# EAGLE design OpticalSpeedometerV1 (EAGLE 9.4.2)
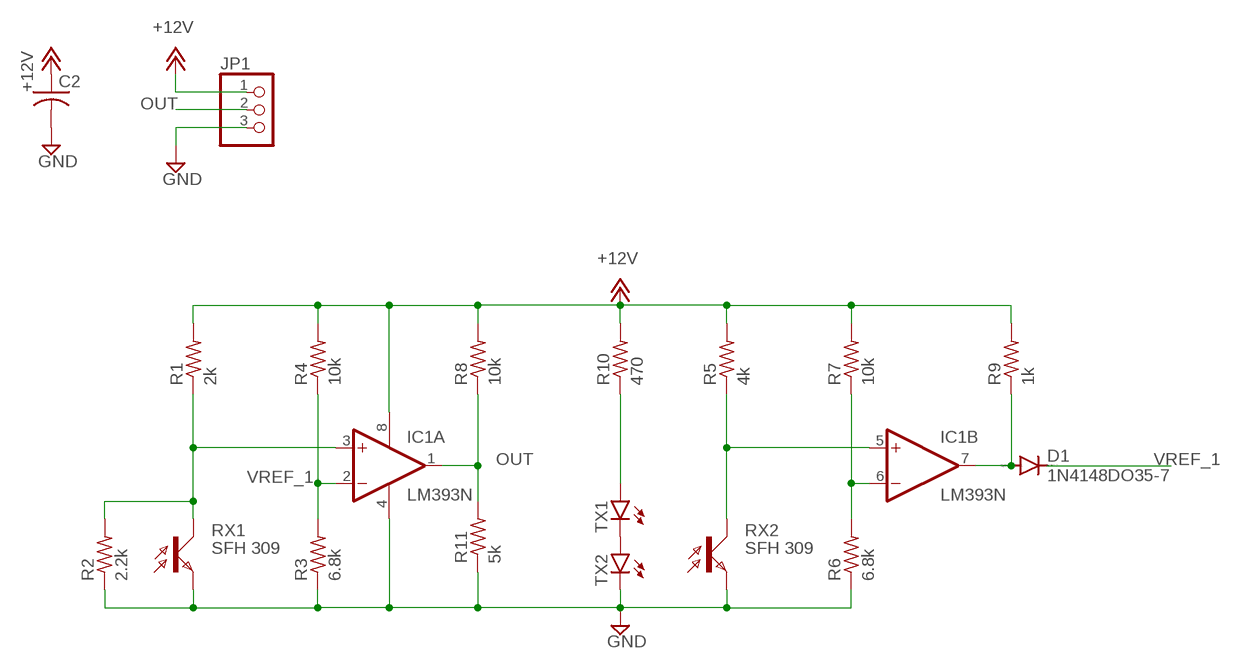
[diagram p0: schematic, sheet 1]

## Parts
C2  C-US050-050X075  [C050-050X075]
D1  1N4148DO35-7  [DO35-7]
IC1  LM393N  [DIL08]
JP1  PINHD-1X3  [1X03]
R1  2k  R-US_0204/5  [0204/5]
R2  2.2k  R-US_0204/5  [0204/5]
R3  6.8k  R-US_0204/5  [0204/5]
R4  10k  R-US_0204/5  [0204/5]
R5  4k  R-US_0204/5  [0204/5]
R6  6.8k  R-US_0204/5  [0204/5]
R7  10k  R-US_0204/5  [0204/5]
R8  10k  R-US_0204/5  [0204/5]
R9  1k  R-US_0204/5  [0204/5]
R10  470  R-US_0204/5  [0204/5]
R11  5k  R-US_0204/5  [0204/5]
RX1  SFH 309  BPX81  [BPX81]
RX2  SFH 309  BPX81  [BPX81]
TX1  LED3MM  [LED3MM]
TX2  LED3MM  [LED3MM]

## Nets
+12V: C2.1 IC1.8(P:V+) JP1.1 R1.2 R4.2 R5.2 R7.2 R8.2 R9.2 R10.2
GND: C2.2 IC1.4(P:V-) JP1.3 R2.1 R3.1 R6.1 R11.1 RX1.E RX2.E TX2.K(C)
N$1: TX1.K(C) TX2.A
N$2: IC1.3(A:+IN) R1.1 R2.2 RX1.C
N$3: R10.1 TX1.A
N$7: IC1.5(B:+IN) R5.1 RX2.C
N$9: IC1.6(B:-IN) R6.2 R7.1
N$10: D1.A IC1.7(B:OUT) R9.1
OUT: IC1.1(A:OUT) JP1.2 R8.1 R11.2
VREF_1: D1.C IC1.2(A:-IN) R3.2 R4.1

## Library data of the parts
C2 = rcl:C-US: CAPACITOR, American symbol; SPICEPREFIX: C
D1 = diode:1N4148: DIODE high speed (Philips)
IC1 = linear:LM393: COMPARATOR
JP1 = pinhead:PINHD-1X3: PIN HEADER
R1-R11 = rcl:R-US_: RESISTOR, American symbol; SPICEPREFIX: R
RX1 RX2 = opto-trans-siemens:BPX81: PHOTO TRANSISTOR; OC_FARNELL: unknown; OC_NEWARK: unknown
TX1 TX2 = led:LED: LED OSRAM: - CHIPLED LG R971, LG N971, LY N971, LG Q971, LY Q971, LO R971, LY R971 LH N974, LH R974 LS Q976, LO Q976, LY Q976 LO Q996 - Hyper CHIPLED LW Q18S LB Q993, LB Q99A, LB R99A - SideLED LS A670, LO A670, LY A670, LG A670, LP A670 LB A673, LV A673, LT A673, LW A673 LH A674 LY A675 LS A676, LA A676, LO A676, LY A676, LW A676 LS A679, LY A679, LG A679 - Hyper Micro SIDELED® LS Y876, LA Y876, LO Y876, LY Y876 LT Y87S - SmartLED LW L88C, LW L88S LB L89C, LB L89S, LG L890 LS L89K, LO L89K, LY L89K LS L896, LA L896, LO L896, LY L896 - TOPLED LS T670, LO T670, LY T670, LG T670, LP T670 LSG T670, LSP T670, LSY T670, LOP T670, LYG T670 LG T671, LOG T671, LSG T671 LB T673, LV T673, LT T673, LW T673 LH T674 LS T676, LA T676, LO T676, LY T676, LB T676, LH T676, LSB T676, LW T676 LB T67C, LV T67C, LT T67C, LS T67K, LO T67K, LY T67K, LW E67C LS E67B, LA E67B, LO E67B, LY E67B, LB E67C, LV E67C, LT E67C LW T67C LS T679, LY T679, LG T679 LS T770, LO T770, LY T770, LG T770, LP T770 LB T773, LV T773, LT T773, LW T773 LH T774 LS E675, LA E675, LY E675, LS T675 LS T776, LA T776, LO T776, LY T776, LB T776 LHGB T686 LT T68C, LB T68C - Hyper Mini TOPLED® LB M676 - Mini TOPLED Santana® LG M470 LS M47K, LO M47K, LY M47K Source: http://www.osram.convergy.de LUXEON: - LUMILED® LXK2-PW12-R00, LXK2-PW12-S00, LXK2-PW14-U00, LXK2-PW14-V00 LXK2-PM12-R00, LXK2-PM12-S00, LXK2-PM14-U00 LXK2-PE12-Q00, LXK2-PE12-R00, LXK2-PE12-S00, LXK2-PE14-T00, LXK2-PE14-U00 LXK2-PB12-K00, LXK2-PB12-L00, LXK2-PB12-M00, LXK2-PB14-N00, LXK2-PB14-P00, LXK2-PB14-Q00 LXK2-PR12-L00, LXK2-PR12-M00, LXK2-PR14-Q00, LXK2-PR14-R00 LXK2-PD12-Q00, LXK2-PD12-R00, LXK2-PD12-S00 LXK2-PH12-R00, LXK2-PH12-S00 LXK2-PL12-P00, LXK2-PL12-Q00, LXK2-PL12-R00 Source: www.luxeon.com KINGBRIGHT: KA-3528ASYC Source: www.kingbright.com

## Board
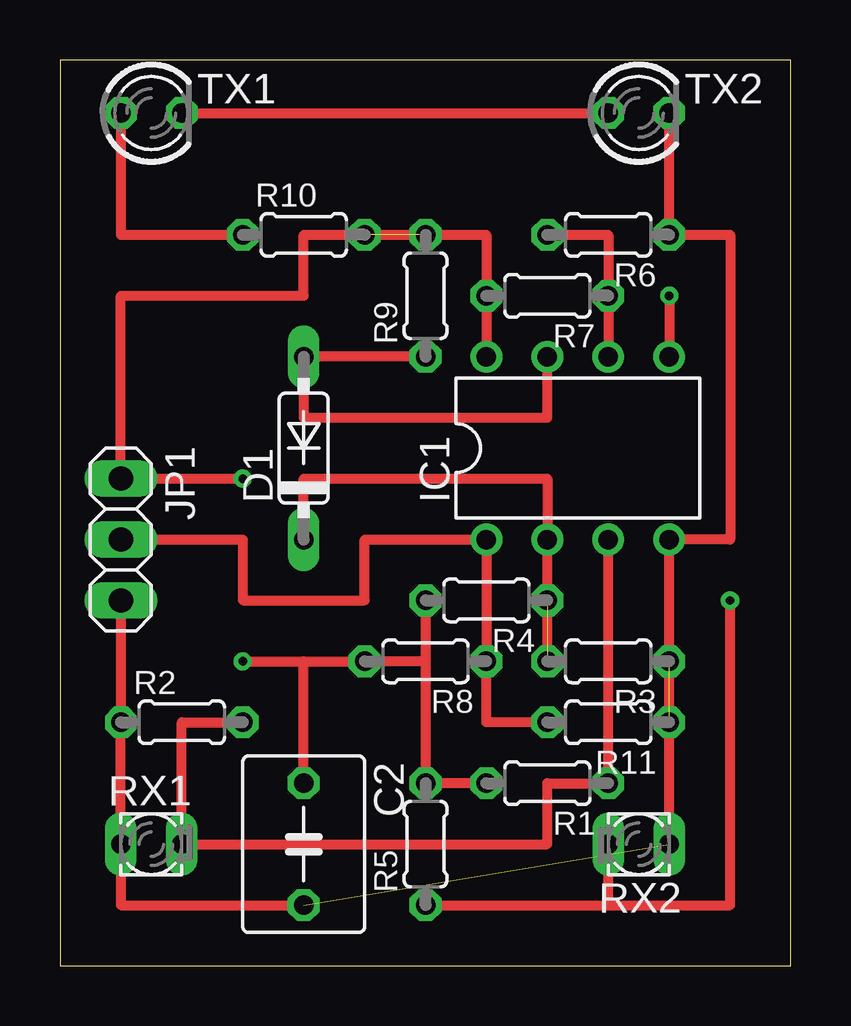
[diagram p1: board, top side]
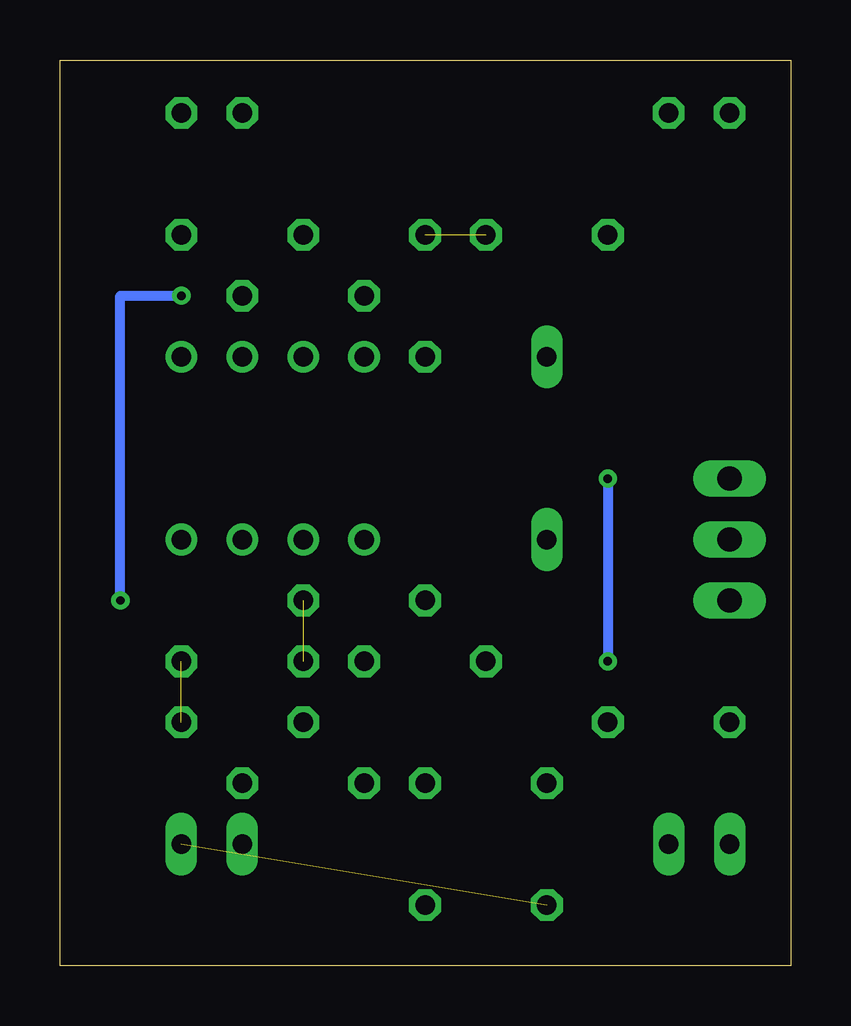
[diagram p2: board, bottom side, seen from below]

Size 30.46 x 37.77 mm. Coordinates in mm from the lower left corner, seen from the top.
Outline: 0,0 30.46,0 30.46,37.77 0,37.77 0,0
Copper layers (1*16): Top 0.035mm / dielectric 1.5mm / Bottom 0.035mm
Design rules "default": minimum track width 6mil, minimum drill 0.35mm, track to track 6mil, track to pad 6mil, pad to pad 6mil, via to via 6mil, smd to smd 6mil, copper to edge 40mil, drill to drill 6mil, minimum pad ring 10mil, minimum via ring 8mil, stop-mask expansion 4mil, vias tented up to drill 0mil, thermal gap 10mil

### Footprints (pad centres in the part's own frame; a part is rotated, then mirrored left to right if it is on the bottom)
C050-050X075 = drill 0.813 octagon: 1 -2.54,0; 2 2.54,0
DO35-7 = drill 0.813 long: A 3.81,0; C -3.81,0
DIL08 = drill 0.813 pad 1.27: 1 -3.81,-3.81; 2 -1.27,-3.81; 3 1.27,-3.81; 4 3.81,-3.81; 5 3.81,3.81; 6 1.27,3.81; 7 -1.27,3.81; 8 -3.81,3.81
1X03 = drill 1.016 long: 1 -2.54,0; 2 0,0; 3 2.54,0
0204/5 = drill 0.813 octagon: 1 -2.54,0; 2 2.54,0
BPX81 = drill 0.813 long: C 1.27,0; E -1.27,0
LED3MM = drill 0.813 octagon: A -1.27,0; K 1.27,0

### Placement (x,y rotation side)
C2  10.16,5.08 270 top
D1  10.16,21.59 90 top
IC1  21.59,21.59 0 top
JP1  2.54,17.78 270 top
R1  20.32,7.62 180 top
R2  5.08,10.16 0 top
R3  22.86,12.7 180 top
R4  17.78,15.24 180 top
R5  15.24,5.08 90 top
R6  22.86,30.48 180 top
R7  20.32,27.94 180 top
R8  15.24,12.7 180 top
R9  15.24,27.94 90 top
R10  10.16,30.48 0 top
R11  22.86,10.16 180 top
RX1  3.81,5.08 0 top
RX2  24.13,5.08 180 top
TX1  3.81,35.56 0 top
TX2  24.13,35.56 0 top

### Tracks (layer width: path | path; a pad name or v marks a point on that pad's centre or on a via)
+12V  (via drill 0.35)  (1 unrouted)
  Top 0.406: R1.2 R5.2 15.24,12.7 | 15.24,12.7 R8.2 10.16,12.7 | IC1.8 R7.2 17.78,30.48 R9.2 10.16,30.48 10.16,27.94 2.54,27.94 JP1.1 v7.62,20.32 | v7.62,12.7 10.16,12.7 | R4.2 15.24,12.7 | C2.1 10.16,12.7
  Bottom 0.406: v7.62,20.32 v7.62,12.7
GND  (2 unrouted)
  Top 0.406: JP1.3 R2.1 RX1.E 2.54,2.54 C2.2 | RX2.E R11.1 IC1.4 27.94,17.78 27.94,30.48 R6.1 TX2.K
N$1
  Top 0.406: TX1.K TX2.A
N$2
  Top 0.406: IC1.3 R1.1 20.32,7.62 20.32,5.08 RX1.C 5.08,10.16 R2.2
N$3
  Top 0.406: TX1.A 2.54,30.48 R10.1
N$7  (via drill 0.35)
  Top 0.406: R5.1 22.86,2.54 | 22.86,2.54 RX2.C | 22.86,2.54 27.94,2.54 v27.94,15.24 | v25.4,27.94 IC1.5
  Bottom 0.406: v27.94,15.24 27.94,27.94 v25.4,27.94
N$9
  Top 0.406: IC1.6 R7.1 22.86,30.48 R6.2
N$10
  Top 0.406: IC1.7 20.32,22.86 10.16,22.86 D1.A R9.1
OUT
  Top 0.406: R11.2 17.78,10.16 R8.1 IC1.1 12.7,17.78 12.7,15.24 7.62,15.24 7.62,17.78 JP1.2
VREF_1  (1 unrouted)
  Top 0.406: R3.2 IC1.2 20.32,20.32 10.16,20.32 D1.C